# Altium schematic sheet LinearRegulator.SchDoc
size A4
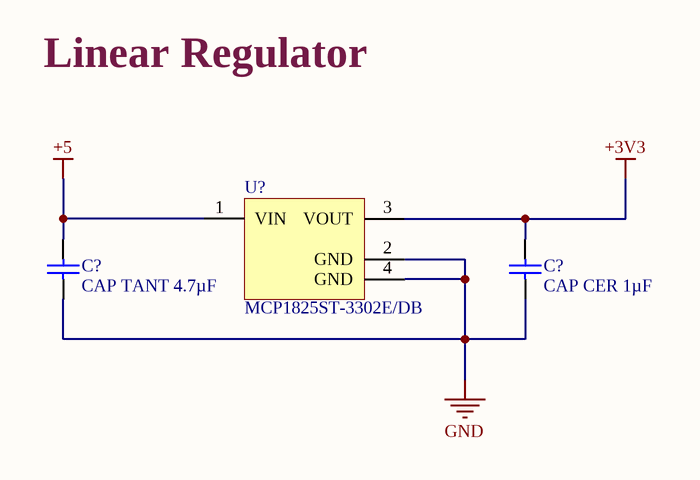
[diagram p0: LinearRegulator.SchDoc]

## Parts
(Parts that share a designator on the sheet are numbered #1, #2 ... from top to bottom, then left to right.)
C?#1  CAP TANT 4.7µF  [CAPC1609X100X15ML20]
C?#2  CAP CER 1µF  [CAPC1608X90X20LL10]
U?  MCP1825ST-3302E/DB  [SOT-223-DB3_L]

## Nets
+3V3: C?#2.2 U?.3(VOUT)
+5: C?#1.2 U?.1(VIN)
GND: C?#1.1 C?#2.1 U?.2(GND) U?.4(GND)

## Notes on the sheet
- Linear Regulator

## Library data of the parts
C?#1 = CMP-2006-00210-1: TPCL475K010R5000 / CAP TANT 4.7UF 10% 10V 0603; Manufacturer: AVX Interconnect / Elco; Part Number: TPCL475K010R5000; ComponentLink1Description: Datasheet; ComponentLink1URL: https://www.digikey.com.au/product-detail/en/avx-corporation/TPCL475K010R5000/478-4961-1-ND/1879558
C?#2 = CMP-2000-06025-1: Chip Capacitor, 1 uF, +/- 10%, 50 V, -55 to 85 degC, 0603 (1608 Metric), RoHS, Tape and Reel / C1608X5R1H105K080AB; Manufacturer: TDK; PCN Part Number: MLCCPartNumberChange30/Nov/2012; Other Names: 445-7468-6; Online Catalog: CSeries,GeneralPurpose; Product Training Modules: CSeriesGeneralApplicationsSEAT,CCV,andTVCLDesignToolsGuidetoReplacinganElectrolyticCapacitorwithanMLCC; Voltage - Rated: 50V; Design Resources: 20WNon-IsolatedBuckLEDDriverUsingPLLNK460KG; Temperature Coefficient: X5R; Series: C; Datasheet Version: 08/2016; Package Description: 2-Pin Surface Mount Device, Body 1.6 x 0.8 mm; Mounting Technology: SurfaceMount; Capacitance: 1µF; Features: -; Size / Dimension: 0.063"Lx0.031"W(1.60mmx0.80mm); Lead Spacing: -; Operating Temperature: -55°C~85°C; Tolerance: ±10%; Height - Seated (Max): -; Mounting Type: SurfaceMount,MLCC; Ratings: -; Standard Package: 1; Applications: GeneralPurpose; Datasheet URL: https://product.tdk.com/info/en/catalog/datasheets/mlcc_commercial_general_en.pdf; Category: Capacitors; Lead Style: -; Packaging: Digi-Reel®; RoHS Information: RoHSCertificate-MLCC; Package / Case: 0603(1608Metric); Package Reference: 0603; Manufacturer URL: http://www.tdk.com/; Thickness (Max): 0.035"(0.90mm); Family: CeramicCapacitors
U? = CMP-0136-00486-1: 500 mA, Low Voltage, Low Quiescent Current LDO Regulator, 3-Pin SOT-223, Extended Temperature, Tape and Reel; DatasheetVersion: revB, Feb-2008; PackageReference: SOT-223-DB3; PackageVersion: revBB, Aug-2009; PackageDescription: 3-Lead Plastic Small Outline Transistor (DB) [SOT-223]